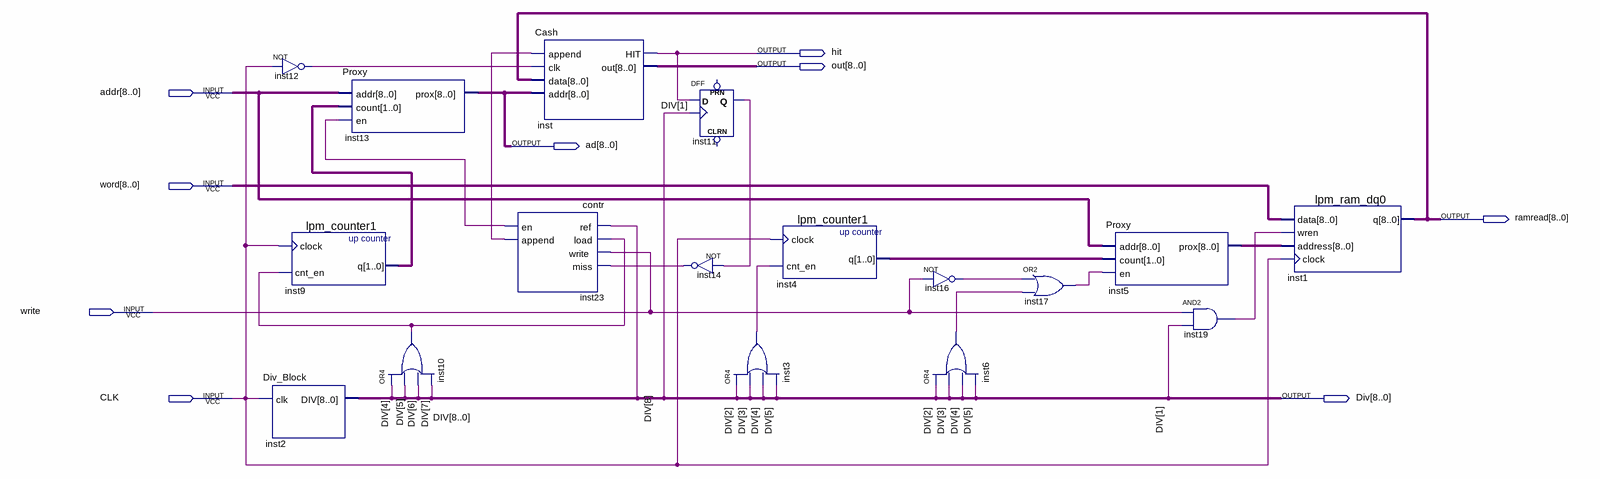
[diagram p0: schematic sheet]
// Quartus schematic Main.bdf as structural Verilog: 17 symbols, 9 pins
module Main (
  input  [8:0] addr,
  input  [8:0] word,
  input  write,
  input  CLK,
  output hit,
  output [8:0] out,
  output [8:0] ad,
  output [8:0] ramread,
  output [8:0] Div
);

  wire inst3_out, inst6_out, inst10_out, inst11_q, inst12_out, inst14_out, inst16_out, inst17_out,
       inst19_out, inst23_append, inst23_en;
  wire [1:0] inst4_q, inst9_q;
  wire [8:0] inst5_prox;

  not inst12 (inst12_out, CLK);
  lpm_counter1 inst9 (.clock(CLK), .cnt_en(inst10_out), .q(inst9_q));
  Div_Block inst2 (.clk(CLK), .DIV(Div));
  Proxy inst13 (.addr(addr), .count(inst9_q), .en(inst23_en), .prox(ad));
  or inst10 (inst10_out, Div[4], Div[5], Div[6], Div[7]);
  contr inst23 (
    .\ref (Div[8]), .load(inst10_out), .write(write), .miss(inst14_out), .en(inst23_en),
    .append(inst23_append));
  Cash inst (.append(inst23_append), .clk(inst12_out), .data(ramread), .addr(ad), .HIT(hit), .out(out));
  DFF inst11 (.CLK(Div[1]), .D(hit), .Q(inst11_q));  // open: CLRN, PRN
  not inst14 (inst14_out, inst11_q);
  or inst3 (inst3_out, Div[2], Div[3], Div[4], Div[5]);
  lpm_counter1 inst4 (.clock(CLK), .cnt_en(inst3_out), .q(inst4_q));
  not inst16 (inst16_out, write);
  or inst6 (inst6_out, Div[2], Div[3], Div[4], Div[5]);
  or inst17 (inst17_out, inst16_out, inst6_out);
  Proxy inst5 (.addr(addr), .count(inst4_q), .en(inst17_out), .prox(inst5_prox));
  and inst19 (inst19_out, write, Div[1]);
  lpm_ram_dq0 inst1 (.data(word), .wren(inst19_out), .address(inst5_prox), .clock(CLK), .q(ramread));
endmodule
